# EAGLE design front_panel (EAGLE 6.5.0)
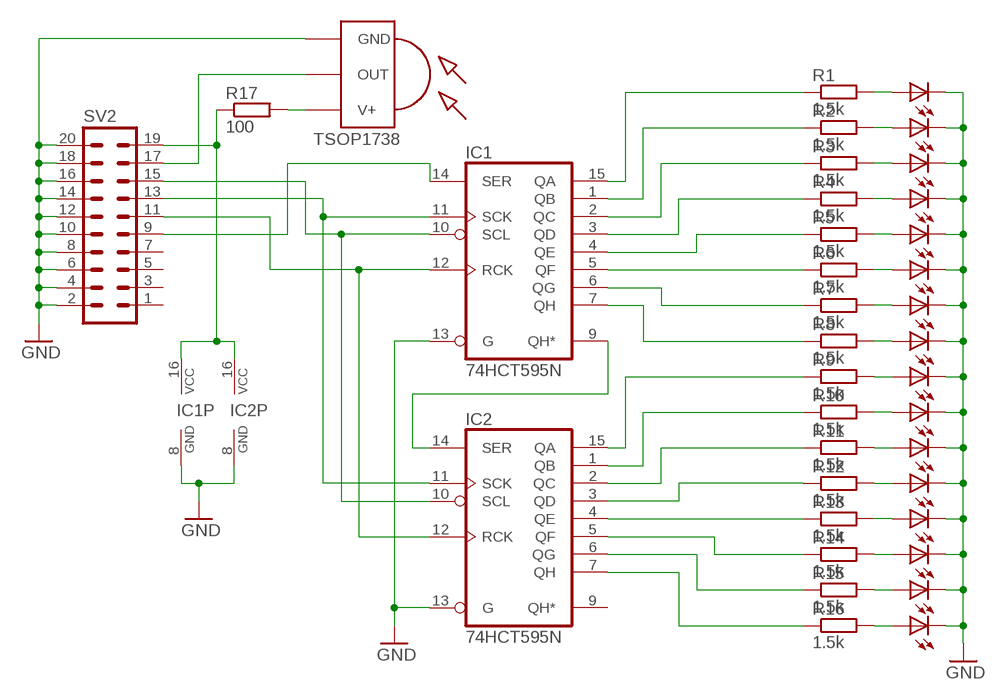
[diagram p0: schematic, sheet 1]

## Parts
IC1  74HCT595N  [DIL16]
IC2  74HCT595N  [DIL16]
R1  1.5k  R-EU_0207/7  [0207/7]
R2  1.5k  R-EU_0207/7  [0207/7]
R3  1.5k  R-EU_0207/7  [0207/7]
R4  1.5k  R-EU_0207/7  [0207/7]
R5  1.5k  R-EU_0207/7  [0207/7]
R6  1.5k  R-EU_0207/7  [0207/7]
R7  1.5k  R-EU_0207/7  [0207/7]
R8  1.5k  R-EU_0207/7  [0207/7]
R9  1.5k  R-EU_0207/7  [0207/7]
R10  1.5k  R-EU_0207/7  [0207/7]
R11  1.5k  R-EU_0207/7  [0207/7]
R12  1.5k  R-EU_0207/7  [0207/7]
R13  1.5k  R-EU_0207/7  [0207/7]
R14  1.5k  R-EU_0207/7  [0207/7]
R15  1.5k  R-EU_0207/7  [0207/7]
R16  1.5k  R-EU_0207/7  [0207/7]
R17  100  R-EU_0207/7  [0207/7]
SV2  MA10-2  [MA10-2]
U$2  LED_RING_16  [POTI_LED_RING16]
U$3  TSOP1738  [TSOP17XX]

## Nets
GND: IC1.8(GND) IC1.13(G) IC2.8(GND) IC2.13(G) SV2.2 SV2.4 SV2.6 SV2.8 SV2.10 SV2.12 SV2.14 SV2.16 SV2.18 SV2.20 U$2.K0 U$2.K1 U$2.K2 U$2.K3 U$2.K4 U$2.K5 U$2.K6 U$2.K7 U$2.K8 U$2.K9 U$2.K10 U$2.K11 U$2.K12 U$2.K13 U$2.K14 U$2.K15 U$3.GND
N$1: IC1.9(QH*) IC2.14(SER)
N$2: R9.2 U$2.A8
N$3: IC1.11(SCK) IC2.11(SCK) SV2.13
N$4: IC1.10(SCL) IC2.10(SCL) SV2.15
N$5: IC1.12(RCK) IC2.12(RCK) SV2.11
N$6: IC1.14(SER) SV2.9
N$7: R1.2 U$2.A0
N$8: R2.2 U$2.A1
N$9: R3.2 U$2.A2
N$10: R4.2 U$2.A3
N$11: R5.2 U$2.A4
N$12: R6.2 U$2.A5
N$13: R7.2 U$2.A6
N$14: R8.2 U$2.A7
N$15: R10.2 U$2.A9
N$16: R11.2 U$2.A10
N$17: R12.2 U$2.A11
N$18: R13.2 U$2.A12
N$19: R14.2 U$2.A13
N$20: R15.2 U$2.A14
N$21: R16.2 U$2.A15
N$22: IC1.15(QA) R1.1
N$23: IC1.1(QB) R2.1
N$24: IC1.2(QC) R3.1
N$25: IC1.3(QD) R4.1
N$26: IC1.7(QH) R8.1
N$27: IC1.6(QG) R7.1
N$28: IC1.5(QF) R6.1
N$29: IC1.4(QE) R5.1
N$30: IC2.15(QA) R9.1
N$31: IC2.1(QB) R10.1
N$32: IC2.2(QC) R11.1
N$33: IC2.3(QD) R12.1
N$34: IC2.7(QH) R16.1
N$35: IC2.6(QG) R15.1
N$36: IC2.5(QF) R14.1
N$37: IC2.4(QE) R13.1
N$39: SV2.17 U$3.OUT
N$40: R17.2 U$3.V+
N$41: IC1.16(VCC) IC2.16(VCC) R17.1 SV2.19
Unconnected: IC2.9(QH*) SV2.1 SV2.3 SV2.5 SV2.7

## Library data of the parts
IC1 IC2 = 74xx-eu:74*595: 8-bit SHIFT REGISTER, output latch
R1-R17 = resistor:R-EU_: RESISTOR, European symbol
SV2 = con-lstb:MA10-2: PIN HEADER; OC_FARNELL: unknown; OC_NEWARK: unknown
U$2 = dreimalbe:LED_RING_16
U$3 = tsop-1:TSOP1738: IR Receiver and Demodulator

## Board
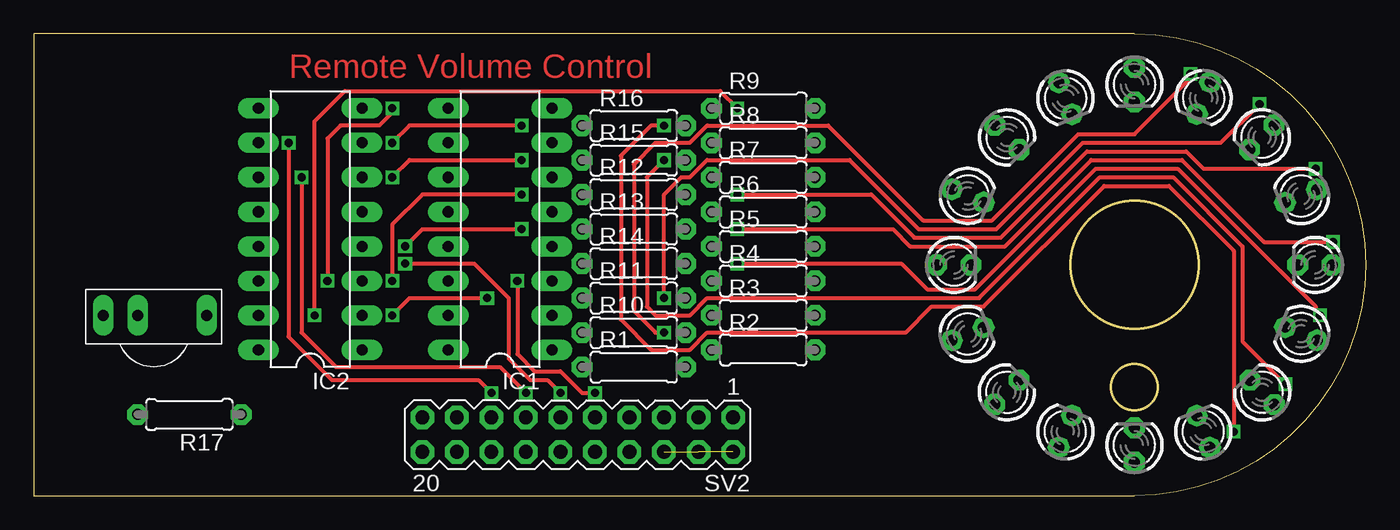
[diagram p1: board, top side]
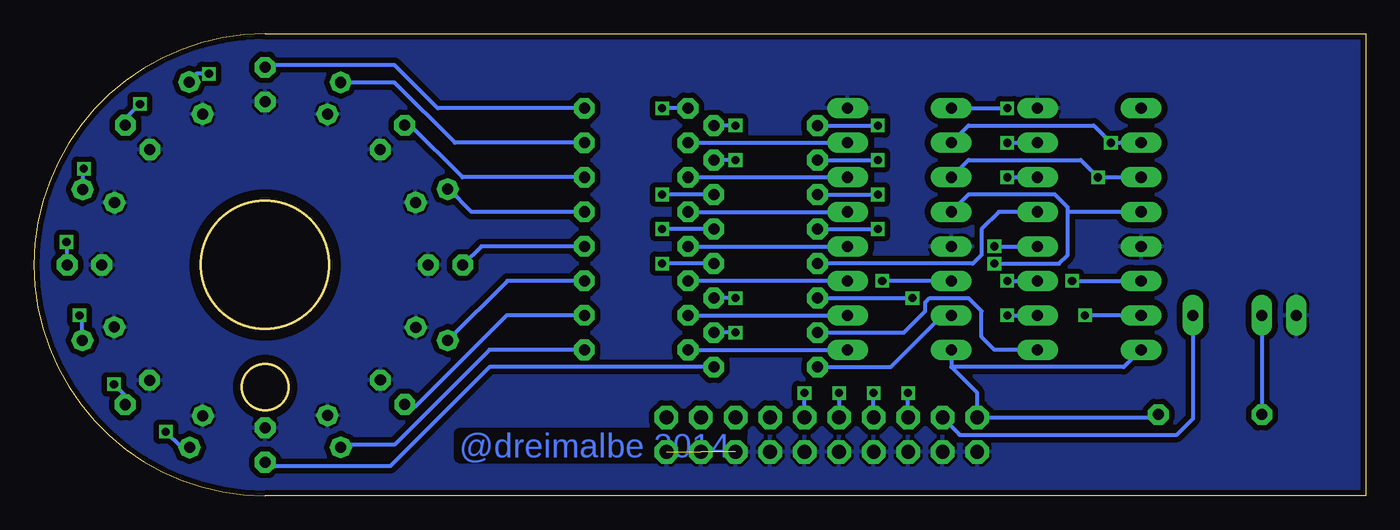
[diagram p2: board, bottom side, seen from below]

Size 97.96 x 34 mm. Coordinates in mm from the lower left corner, seen from the top.
Outline: 0,0 80.96,0 arc90 97.96,17 arc90 80.96,34 0,34 0,0
Copper layers (1*16): Top 0.035mm / dielectric 1.5mm / Bottom 0.035mm
Design rules "pcb-devboards_35þmCU_200þm_Strukturen_Abstaende *": minimum track width 0.2mm, minimum drill 0.3mm, track to track 0.2mm, track to pad 0.2mm, pad to pad 0.2mm, via to via 0.2mm, smd to smd 0.2mm, copper to edge 0.4mm, drill to drill 0.4mm, minimum pad ring 14mil, minimum via ring 0.2mm, stop-mask expansion 4mil, vias tented up to drill 0mil, thermal gap 0.2mm

### Footprints (pad centres in the part's own frame; a part is rotated, then mirrored left to right if it is on the bottom)
DIL16 = drill 0.813 long: 1 -8.89,-3.81; 2 -6.35,-3.81; 3 -3.81,-3.81; 4 -1.27,-3.81; 5 1.27,-3.81; 6 3.81,-3.81; 7 6.35,-3.81; 8 8.89,-3.81; 9 8.89,3.81; 10 6.35,3.81; 11 3.81,3.81; 12 1.27,3.81; 13 -1.27,3.81; 14 -3.81,3.81; 15 -6.35,3.81; 16 -8.89,3.81
0207/7 = drill 0.813 octagon: 1 -3.81,0; 2 3.81,0
MA10-2 = drill 1.016 octagon: 1 -11.43,-1.27; 2 -11.43,1.27; 3 -8.89,-1.27; 4 -8.89,1.27; 5 -6.35,-1.27; 6 -6.35,1.27; 7 -3.81,-1.27; 8 -3.81,1.27; 9 -1.27,-1.27; 10 -1.27,1.27; 11 1.27,-1.27; 12 1.27,1.27; 13 3.81,-1.27; 14 3.81,1.27; 15 6.35,-1.27; 16 6.35,1.27; 17 8.89,-1.27; 18 8.89,1.27; 19 11.43,-1.27; 20 11.43,1.27
POTI_LED_RING16 = drill 0.813 octagon: A0 0,-14.53; A1 -5.568,-13.43; A2 -10.281,-10.274; A3 -13.441,-5.562; A4 -14.545,0; A5 -13.435,5.569; A6 -10.272,10.279; A7 -5.561,13.434; A8 0,14.545; A9 5.572,13.457; A10 10.272,10.29; A11 13.426,5.548; A12 14.55,0; A13 13.437,-5.554; A14 10.296,-10.285; A15 5.554,-13.444; K0 0,-11.99; K1 -4.596,-11.083; K2 -8.485,-8.478; K3 -11.095,-4.59; K4 -12.005,0; K5 -11.088,4.597; K6 -8.476,8.483; K7 -4.589,11.087; K8 0,12.005; K9 4.6,11.11; K10 8.476,8.494; K11 11.079,4.576; K12 12.01,0; K13 11.091,-4.582; K14 8.499,-8.489; K15 4.582,-11.097
TSOP17XX = drill 0.813 long: GND -3.81,0; OUT 3.81,0; V+ -1.27,0

### Placement (x,y rotation side)
IC1  34.29,19.64 90 top
IC2  20.32,19.64 90 top
R1  44.13,9.48 0 top
R2  53.66,10.75 0 top
R3  53.66,13.29 0 top
R4  53.66,15.83 0 top
R5  53.66,18.37 0 top
R6  53.66,20.91 0 top
R7  53.66,23.45 0 top
R8  53.66,25.99 0 top
R9  53.66,28.53 0 top
R10  44.13,12.02 0 top
R11  44.13,14.56 0 top
R12  44.13,22.18 0 top
R13  44.13,19.64 0 top
R14  44.13,17.1 0 top
R15  44.13,24.72 0 top
R16  44.13,27.26 0 top
R17  11.43,5.98 180 top
SV2  40,4.5 180 top
U$2  80.96,17 0 top
U$3  8.89,13.29 0 top

### Tracks (layer width: path | path; a pad name or v marks a point on that pad's centre or on a via)
GND  (2 unrouted)
  pour Bottom (isolate 0.406): 0,33.92 99.69,33.92 99.69,-0.05 0,-0.05
N$1  (via drill 0.6)
  Top 0.305: v26.35,28.53 26.35,28.21 25.4,27.26 22.54,27.26 21.59,26.3 v21.59,15.83
  Bottom 0.305: IC1.9 v26.35,28.53 | v21.59,15.83 IC2.14
N$2
  Bottom 0.305: R9.2 68.26,28.53 71.44,31.7 80.27,31.7 80.42,31.55 U$2.A8
N$3  (via drill 0.6)
  Top 0.305: v19.68,23.45 19.68,12.02 22.23,9.48 34.29,9.48 v36.2,7.57
  Bottom 0.305: IC1.11 29.21,24.72 20.95,24.72 v19.68,23.45 IC2.11 | SV2.13 v36.19,7.57 v36.2,7.57
N$4  (via drill 0.6)
  Top 0.305: v18.73,25.99 18.73,11.7 21.91,8.52 32.7,8.52 v33.66,7.57
  Bottom 0.305: IC1.10 29.21,27.26 20,27.26 v18.73,25.99 IC2.10 | SV2.15 v33.65,7.57 v33.66,7.57
N$5  (via drill 0.6)
  Top 0.305: v27.3,17.1 32.38,17.1 34.92,14.56 34.92,10.11 36.51,8.52 37.78,8.52 v38.73,7.57
  Bottom 0.305: IC2.12 21.91,20.91 | v27.3,17.1 22.54,17.1 21.91,17.73 21.91,20.91 | 21.91,20.91 21.91,21.23 22.86,22.18 29.21,22.18 IC1.12 | v38.73,7.57 SV2.11
N$6  (via drill 0.6)
  Top 0.305: v35.56,15.83 35.56,10.43 36.83,9.16 38.73,9.16 40.32,7.57 v41.27,7.57
  Bottom 0.305: IC1.14 v35.56,15.83 | SV2.9 v41.27,7.57
N$7
  Bottom 0.305: R1.2 64.45,9.48 71.75,2.18 80.51,2.18
  Bottom 0.406: 80.51,2.18 80.96,2.18 U$2.A0
N$8
  Bottom 0.305: R2.2 64.45,10.75 71.44,3.76 75.2,3.76 U$2.A1
N$9
  Bottom 0.305: R3.2 63.18,13.29 69.85,6.62 70.58,6.62 U$2.A2
N$10
  Bottom 0.305: R4.2 63.13,15.83 U$2.A3
N$11
  Bottom 0.305: R5.2 65.05,18.37 U$2.A4
N$12
  Bottom 0.305: R6.2 65.77,20.91 67.43,22.57 U$2.A5
N$13
  Bottom 0.305: R7.2 66.44,23.45 70.28,27.28 U$2.A6
N$14
  Bottom 0.305: R8.2 66.99,25.99 71.44,30.43 U$2.A7
N$15  (via drill 0.6)
  Top 0.305: v46.35,12.02 45.72,12.02 44.13,13.6 44.13,24.4 45.72,25.99 48.26,25.99 49.53,27.26 58.42,27.26 65.41,20.27 70.48,20.27 76.83,26.62 80.96,26.62 85.09,30.75 v85.09,31.07
  Bottom 0.305: v46.35,12.02 R10.2 | v85.09,31.07 86.02,31.07 86.53,30.55 U$2.A9
N$16  (via drill 0.6)
  Top 0.305: v46.35,14.56 46.35,22.18 47.62,23.45 48.26,23.45 49.53,24.72 60.01,24.72 65.09,19.64 70.8,19.64 77.15,25.99 87.31,25.99 v90.17,28.84
  Bottom 0.305: v46.35,14.56 R11.2 | v90.17,28.84 91.23,27.78 U$2.A10
N$17  (via drill 0.6)
  Top 0.305: v51.75,22.18 61.59,22.18 64.77,19 71.12,19 77.47,25.35 84.77,25.35 86.04,24.08 v94.3,24.08
  Bottom 0.305: R12.2 v51.75,22.18 | v94.3,24.08 94.39,23.99 U$2.A11
N$18  (via drill 0.6)
  Top 0.305: v51.75,19.64 63.18,19.64 64.45,18.37 71.44,18.37 77.79,24.72 84.45,24.72 90.49,18.69 v95.57,18.69
  Bottom 0.305: R13.2 v51.75,19.64 | v95.57,18.69 95.57,17.05 U$2.A12
N$19  (via drill 0.6)
  Top 0.305: v51.75,17.1 63.82,17.1 65.72,15.19 69.22,15.19 78.11,24.08 84.14,24.08 94.3,13.92 94.3,13.6 v94.61,13.29
  Bottom 0.305: R14.2 v51.75,17.1 | U$2.A13 94.4,13.07 v94.61,13.29
N$20  (via drill 0.6)
  Top 0.305: v46.35,24.72 45.09,23.45 45.09,13.92 45.72,13.29 48.26,13.29 49.53,14.56 69.53,14.56 78.42,23.45 83.82,23.45 88.9,18.37 88.9,11.38 v92.08,8.21
  Bottom 0.305: v46.35,24.72 R15.2 | U$2.A14 91.26,7.39 v92.08,8.21
N$21  (via drill 0.6)
  Top 0.305: v46.35,27.26 45.4,27.26 43.18,25.03 43.18,12.97 45.4,10.75 48.26,10.75 49.53,12.02 64.14,12.02 66.04,13.92 69.85,13.92 78.74,22.81 83.5,22.81 88.27,18.05 v88.27,4.72
  Bottom 0.305: v46.35,27.26 R16.2 | U$2.A15 87.11,3.56 v88.27,4.72
N$22
  Bottom 0.305: IC1.15 31.11,13.29 34.92,9.48 R1.1
N$23
  Bottom 0.305: R2.1 IC1.1
N$24
  Bottom 0.305: R3.1 IC1.2
N$25
  Bottom 0.305: IC1.3 R4.1
N$26
  Bottom 0.305: R8.1 IC1.7
N$27
  Bottom 0.305: R7.1 IC1.6
N$28
  Bottom 0.305: R6.1 IC1.5
N$29
  Bottom 0.305: R5.1 IC1.4
N$30  (via drill 0.6)
  Top 0.305: v51.75,28.53 50.48,29.8 22.86,29.8 20.64,27.57 v20.64,13.29
  Bottom 0.305: R9.1 v51.75,28.53 | IC2.15 v20.64,13.29
N$31
  Bottom 0.305: R10.1 33.97,12.02 32.38,13.6 32.38,14.24 32.07,14.56 29.21,14.56 28.26,13.6 28.26,11.7 27.3,10.75 IC2.1
N$32  (via drill 0.6)
  Top 0.305: v26.35,13.29 27.62,14.56 v33.34,14.56
  Bottom 0.305: v26.35,13.29 IC2.2 | R11.1 v33.34,14.56
N$33  (via drill 0.6)
  Top 0.305: v35.88,22.18 28.57,22.18 26.35,19.96 v26.35,15.83
  Bottom 0.305: R12.1 v35.88,22.18 | v26.35,15.83 IC2.3
N$34  (via drill 0.6)
  Top 0.305: v35.88,27.26 27.62,27.26 v26.35,25.99
  Bottom 0.305: R16.1 v35.88,27.26 | v26.35,25.99 IC2.7
N$35  (via drill 0.6)
  Top 0.305: v26.35,23.45 27.62,24.72 v35.88,24.72
  Bottom 0.305: R15.1 v35.88,24.72 | v26.35,23.45 IC2.6
N$36
  Bottom 0.305: IC2.5 26.99,20.91 28.26,19.64 28.26,17.73 28.89,17.1 R14.1
N$37  (via drill 0.6)
  Top 0.305: v27.3,18.37 28.57,19.64 v35.88,19.64
  Bottom 0.305: R13.1 v35.88,19.64 | v27.3,18.37 IC2.4
N$39
  Bottom 0.305: U$3.OUT 12.7,5.67 13.87,4.5 29.9,4.5 29.9,4.56 SV2.17 31.07,5.77
N$40
  Bottom 0.305: U$3.V+ R17.2
N$41
  Bottom 0.305: IC2.16 17.78,9.48 30.48,9.48 | IC1.16 30.48,9.48 | 30.48,9.48 28.57,7.57 SV2.19 15.46,5.77 R17.1

### Text on the board
Top: Remote Volume Control
Bottom: @dreimalbe 2014